# EAGLE schematic board 3 (EAGLE 8.4.1)
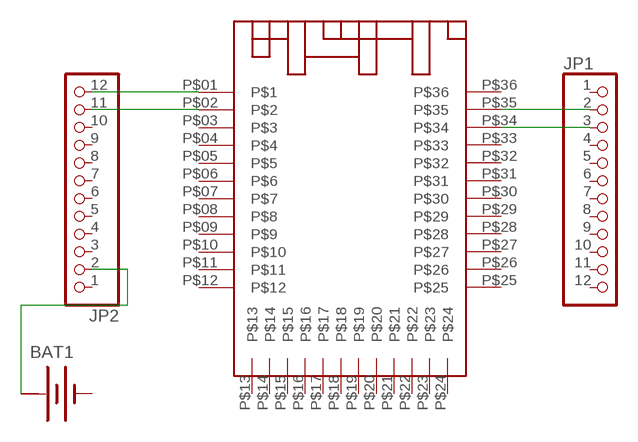
[diagram p0: schematic, sheet 1]

## Parts
BAT1  BATTERY  [BATTERY]
JP1  PINHD-1X12  [1X12]
JP2  PINHD-1X12/90  [1X12/90]
U$1  HZX_MODULE  [SMD_PAD_VERSION]

## Nets
N$2: BAT1.+ JP2.2
N$11: JP2.11 U$1.P$02
N$12: JP2.12 U$1.P$01
N$14: JP1.2 U$1.P$35
N$15: JP1.3 U$1.P$34
Unconnected: JP1.1 JP1.4 JP1.5 JP1.6 JP1.7 JP1.8 JP1.9 JP1.10 JP1.11 JP1.12 JP2.1 JP2.3 JP2.4 JP2.5 JP2.6 JP2.7 JP2.8 JP2.9 JP2.10 U$1.P$03 U$1.P$04 U$1.P$05 U$1.P$06 U$1.P$07 U$1.P$08 U$1.P$09 U$1.P$10 U$1.P$11 U$1.P$12 U$1.P$13 U$1.P$14 U$1.P$15 U$1.P$16 U$1.P$17 U$1.P$18 U$1.P$19 U$1.P$20 U$1.P$21 U$1.P$22 U$1.P$23 U$1.P$24 U$1.P$25 U$1.P$26 U$1.P$27 U$1.P$28 U$1.P$29 U$1.P$30 U$1.P$31 U$1.P$32 U$1.P$33 U$1.P$36

## Power pins joined to a net without a drawn wire
+: BAT1.+@1(+)
-: BAT1.-

## Library data of the parts
BAT1 = special:BATTERY: BATTERY
JP1 JP2 = pinhead:PINHD-1X12: PIN HEADER
U$1 = HZX_MODULE:HZX_MODULE; AUTHOR: Agam